# Altium schematic sheet Esquematico.SchDoc
size A4
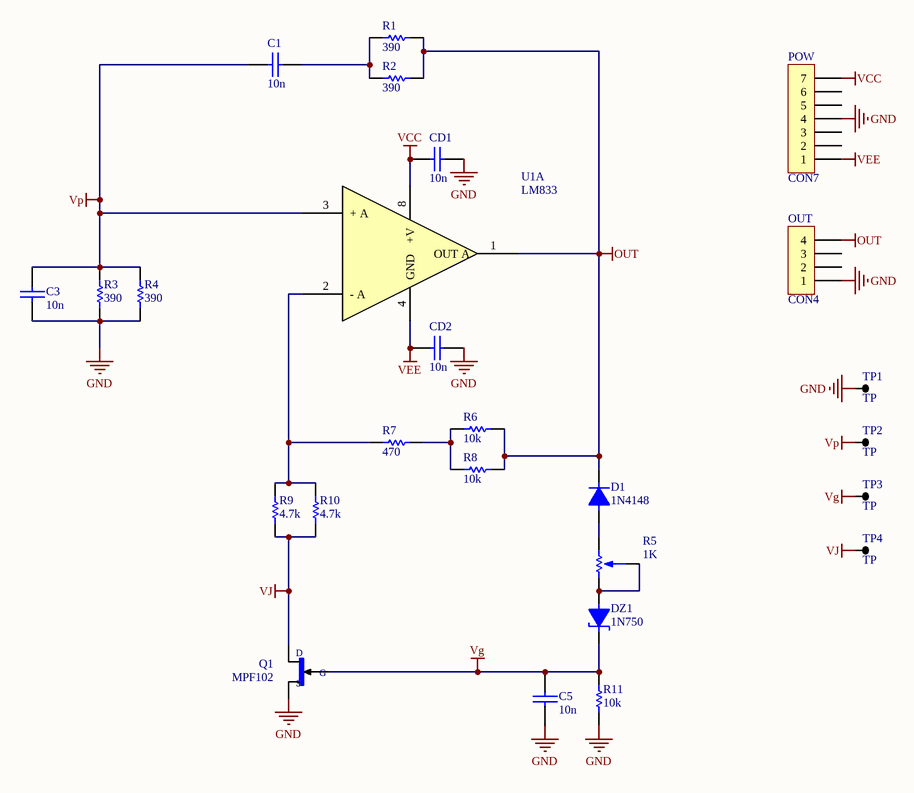
[diagram p0: Esquematico.SchDoc]

## Parts
C1  10n  [CAP200]
C3  10n  [CAP200]
C5  10n  [CAP200]
CD1  10n  [CAP200]
CD2  10n  [CAP200]
D1  1N4148  [DO41]
DZ1  1N750  [DO41]
OUT  CON4  [SIP4]
POW  CON7  [SIP7]
Q1  MPF102  [*TO92F]
R1  390  [0805]
R2  390  [0805]
R3  390  [0805]
R4  390  [0805]
R5  1K  [PRESET V]
R6  10k  [0805]
R7  470  [0805]
R8  10k  [0805]
R9  4.7k  [0805]
R10  4.7k  [0805]
R11  10k  [0805]
TP1  TP  [TPTH]
TP2  TP  [TPTH]
TP3  TP  [TPTH]
TP4  TP  [TPTH]
U1  LM833  [DIP8]  (part A of 2)

## Nets
GND: C3.2 C5.1 CD1.2 CD2.2 OUT.1 POW.4 Q1.2(S) R3.1 R4.1 R11.1 TP1.1
OUT: D1.2 OUT.4 R1.1 R2.1 R6.1 R8.1 U1.1(OUT_A)
VCC: CD1.1 POW.7 U1.8(+V)
VEE: CD2.1 POW.1 U1.4(GND)
Vg: C5.2 DZ1.2 Q1.3(G) R11.2 TP3.1
VJ: Q1.1(D) R9.1 R10.1 TP4.1
Vp: C1.1 C3.1 R3.2 R4.2 TP2.1 U1.3(+_A)
NetC1_2: C1.2 R1.2 R2.2
NetD1_1: D1.1 R5.1
NetDZ1_1: DZ1.1 R5.2 R5.3
NetR6_2: R6.2 R7.1 R8.2
NetR7_2: R7.2 R9.2 R10.2 U1.2(-_A)

Not connected (* = marked no-connect by the designer): OUT 2 3; POW 2 3 5 6

## Library data of the parts
C1 C3 C5 CD1 CD2 = CAP
D1 = DIODO
DZ1 = DIODO ZENER
Q1 = MPF102: JFET 25V 10mA; MF: ON Semiconductor; Package: TO-226-3 ON Semiconductor; Price: None; SnapEDA_Link: https://www.snapeda.com/parts/MPF102/ON%20Semiconductor/view-part/?ref=snap; MP: MPF102; Availability: Unavailable; Value: *
R1-R4 R6-R11 = RES
R5 = PRESET
U1 = LM833: Dual Audio Operational Amplifier